# Altium schematic sheet HBridge.SchDoc
size 381 x 241 mm
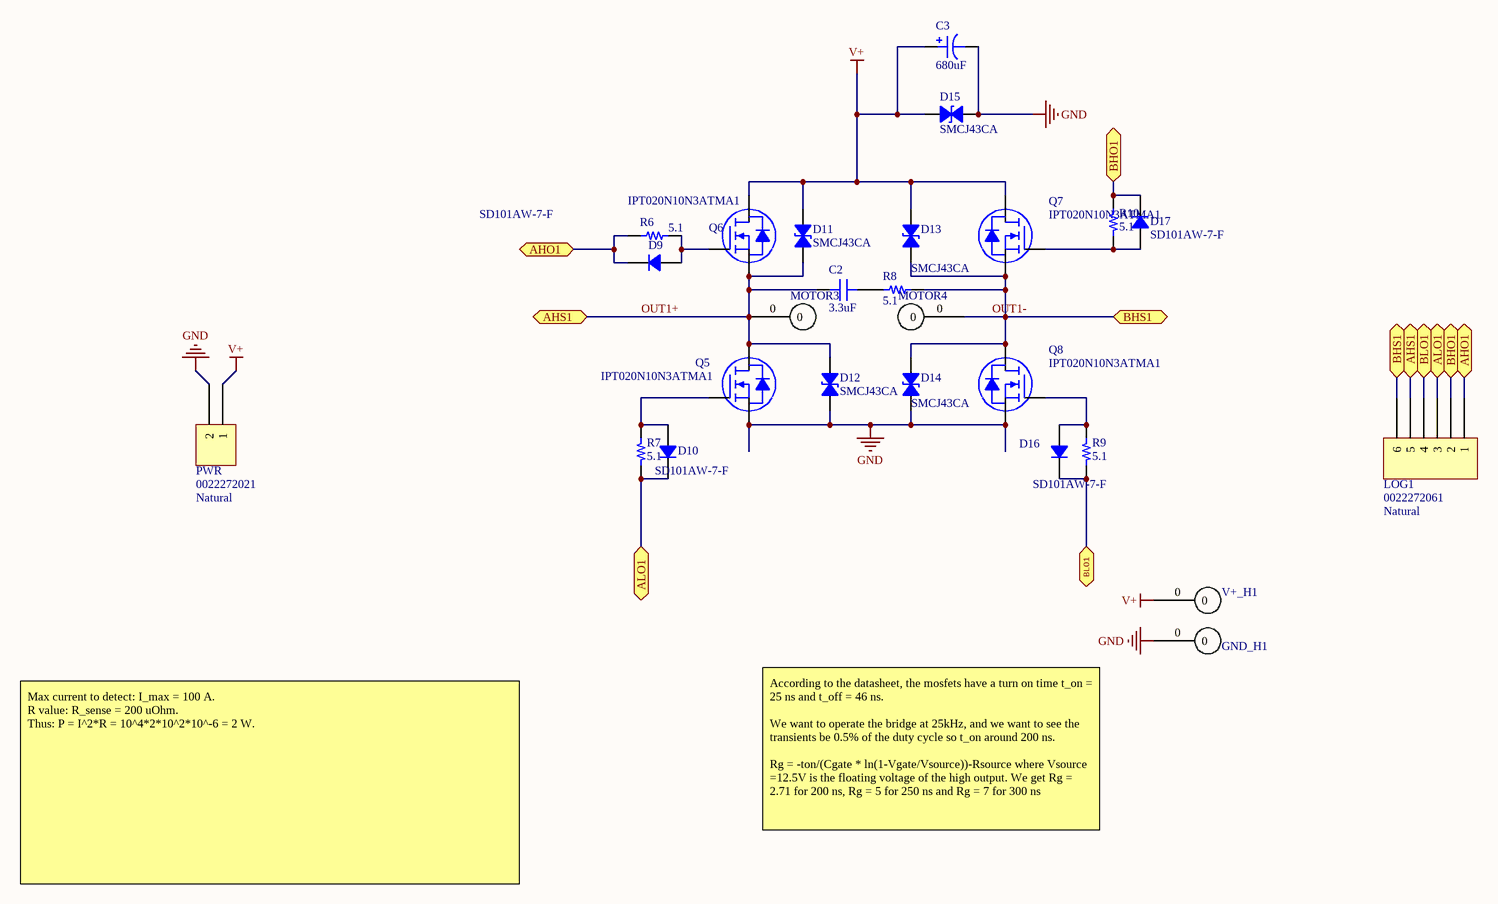
[diagram p0: HBridge.SchDoc]

## Parts
C2  3.3uF  [CAP 1206/3216 - 1.8MM]
C3  680uF  [Radial Capacitor 12.5mm]
D9  SD101AW-7-F  [SOD-123]
D10  SD101AW-7-F  [SOD-123]
D11  SMCJ43CA  [ST DO214AB SMC]
D12  SMCJ43CA  [ST DO214AB SMC]
D13  SMCJ43CA  [ST DO214AB SMC]
D14  SMCJ43CA  [ST DO214AB SMC]
D15  SMCJ43CA  [ST DO214AB SMC]
D16  SD101AW-7-F  [SOD-123]
D17  SD101AW-7-F  [SOD-123]
GND_H1  Cable Hole 6.54mm  [Cable Hole 6.54mm]  (value not drawn)
LOG1  0022272061  Colour: Natural  [MOLEX KK 0022272061]
MOTOR3  H1  [Cable Hole 6.54mm]  (value not drawn)
MOTOR4  H2  [Cable Hole 6.54mm]  (value not drawn)
PWR  0022272021  Colour: Natural  [MOLEX KK 0022272021]
Q5  IPT020N10N3ATMA1  [INFINEON PG-HSOF-8-1]
Q6  IPT020N10N3ATMA1  [INFINEON PG-HSOF-8-1]
Q7  IPT020N10N3ATMA1  [INFINEON PG-HSOF-8-1]
Q8  IPT020N10N3ATMA1  [INFINEON PG-HSOF-8-1]
R6  5.1  [RES 1206/3216]
R7  5.1  [RES 1206/3216]
R8  5.1  [RES 1206/3216]
R9  5.1  [RES 1206/3216]
R10  5.1  [RES 1206/3216]
V+_H1  Cable Hole 6.54mm  [Cable Hole 6.54mm]  (value not drawn)

## Ports
AHO1, AHS1, ALO1, BHO1, BHS1, BLO1

## Nets
GND: C3.2 D12.1 D14.1 D15.2 GND_H1.0 PWR.2 Q5.2(S) Q5.3(S) Q5.4(S) Q5.5(S) Q5.6(S) Q5.7(S) Q5.8(S) Q8.2(S) Q8.3(S) Q8.4(S) Q8.5(S) Q8.6(S) Q8.7(S) Q8.8(S)
V+: C3.1 D11.2 D13.2 D15.1 PWR.1 Q6.9(D) Q7.9(D) V+_H1.0
AHO1: D9.2 LOG1.1 R6.1 ; port AHO1
ALO1: D10.2 LOG1.3 R7.2 ; port ALO1
BHO1: D17.2 LOG1.2 R10.1 ; port BHO1
BLO1: D16.2 LOG1.4 R9.2 ; port BLO1
OUT1+: C2.1 D11.1 D12.2 LOG1.5 MOTOR3.0 Q5.9(D) Q6.2(S) Q6.3(S) Q6.4(S) Q6.5(S) Q6.6(S) Q6.7(S) Q6.8(S) ; port AHS1
OUT1-: D13.1 D14.2 LOG1.6 MOTOR4.0 Q7.2(S) Q7.3(S) Q7.4(S) Q7.5(S) Q7.6(S) Q7.7(S) Q7.8(S) Q8.9(D) R8.2 ; port BHS1
NetC2_2: C2.2 R8.1
NetD9_1: D9.1 Q6.1(G) R6.2
NetD10_1: D10.1 Q5.1(G) R7.1
NetD16_1: D16.1 Q8.1(G) R9.1
NetD17_1: D17.1 Q7.1(G) R10.2

## Notes on the sheet
- According to the datasheet, the mosfets have a turn on time t_on = 25 ns and t_off = 46 ns.
  We want to operate the bridge at 25kHz, and we want to see the transients be 0.5% of the duty cycle so t_on around 200 ns.
  Rg = -ton/(Cgate * ln(1-Vgate/Vsource))-Rsource where Vsource =12.5V is the floating voltage of the high output. We get Rg = 2.71 for 200 ns, Rg = 5 for 250 ns and Rg = 7 for 300 ns
- Max current to detect: I_max = 100 A.
  R value: R_sense = 200 uOhm.
  Thus: P = I^2*R = 10^4*2*10^2*10^-6 = 2 W.

## Library data of the parts
C2 = CGA5L3X7S2A335K160AB: CAP CER 3.3UF 100V X7S 1206; Manufacturer: TDK Corporation; TemperatureRange: -55C ~ 125C; Tolerance: 10%; Value: 3.3uF; Part Number: CGA5L3X7S2A335K160AB; PartId: 17985; Supplier 1: Digi-Key; Supplier Part Number 1: 445-15583-2-ND; ComponentLink1Description: Datasheet; ComponentLink1URL: https://product.tdk.com/info/en/catalog/datasheets/mlcc_automotive_midvoltage_en.pdf; ComponentLink2Description: Digi-Key Listing; ComponentLink2URL: https://www.digikey.com/product-detail/en/tdk-corporation/CGA5L3X7S2A335K160AB/445-15583-2-ND/4278316; TemperatureCoefficient: X7S; Voltage: 100V; Price: 0.6319; Device Package: 1206 (3216 Metric)
C3 = EEUFR1J681L: CAP ALUM 680UF 20% 63V Through Hole; Manufacturer: Panasonic; TemperatureRange: -40C ~ 105C; Type: General Purpose; Ripple Current: 2.78A @ 100kHz; Impedance: 21 mOhms; Lifetime @ Temp: 10000 Hrs @ 105°C; Value: 680uF; Part Number: EEUFR1J681L; PartId: 7484; Supplier 1: Farnell; Supplier Part Number 1: 2079311; ComponentLink1Description: Datasheet; ComponentLink1URL: http://www.farnell.com/datasheets/1897635.pdf?_ga=2.93240925.115427954.1506775348-490126870.1506116288&_gac=1.115494644.1506116288.CjwKCAjw6ZLOBRALEiwAxzyCWz0InfLjFu8mp1t2E94Bo3V2sP4VEUhaMoYFsFDilr1LV; ComponentLink2Description: Farnell Listing; ComponentLink2URL: http://fr.farnell.com/panasonic-electronic-components/eeufr1j681l/condensateur-elec-alu-680uf-63v/dp/2079311; Tolerance: 20%; Voltage: 63V; Price: 1.93; Device Package: Radial, Can
D9 D10 D16 D17 = SD101AW-7-F: DIODE SCHOTTKY 60V 15MA SOD123; Manufacturer: Diodes Incorporated; Current Reverse Leakage @ Vr: 200nA @ 50V; Reverse Recovery Time (trr): 1ns; Current Rectified: 15mA (DC); Voltage Forward (Vf): 1V @ 15mA; Part Number: SD101AW-7-F; PartId: 14608; Supplier 1: Digi-Key; Supplier Part Number 1: SD101AW-7FDITR-ND; ComponentLink1Description: Datasheet; ComponentLink1URL: http://www.diodes.com/_files/datasheets/ds11012.pdf; ComponentLink2Description: Digi-Key Listing; ComponentLink2URL: https://www.digikey.com/product-detail/en/diodes-incorporated/SD101AW-7-F/SD101AW-7FDITR-ND/1155357; Junction Operating Temperature: -65C ~ 125C; Price: 0.081; Type: Schottky; Device Package: SOD-123; Voltage DC Reverse (Vr): 60V
D11-D15 = SMCJ43CA: TVS DIODE 43VWM 69.4VC SMC; Manufacturer: FAIRCHILD; Type: Zener; Bidirectional Channels: 1; Power - Peak Pulse: 1500W (1.5kW); Current - Peak Pulse: 21.6 (10/1000); Voltage (Clamping): 69.4V; Voltage (Breakdown): 52.8V; Voltage (Reverse Standoff): 43V; Part Number: SMCJ43CA; PartId: 14960; Supplier 1: Farnell; Supplier Part Number 1: 1651632; ComponentLink1Description: Datasheet; ComponentLink1URL: https://www.fairchildsemi.com/datasheets/SM/SMCJ100A.pdf; ComponentLink2Description: Farnell Listing; ComponentLink2URL: http://fr.farnell.com/on-semiconductor-fairchild/smcj43ca/diode-tvs/dp/1651632; Operating Temperature: -55C ~ 150C (TJ); Price: 0.492; Device Package: DO-214AB, SMC
GND_H1 MOTOR3 MOTOR4 V+_H1 = Cable Pad AWG 2: Number of Positions: 1; Part Number: Cable Pad AWG 2; PartId: 10977
LOG1 = 0022272061: CONN HEADER 6POS .100 VERT TIN; Manufacturer: Molex, LLC; Pitch: 0.100" (2.54mm); Number Of Positions: 6; Part Number: 0022272061; PartId: 9723; Supplier 1: Digi-Key; Supplier Part Number 1: WM4115-ND; ComponentLink1Description: Datasheet; ComponentLink1URL: http://www.molex.com/pdm_docs/sd/022272061_sd.pdf; ComponentLink2Description: Digi-Key Listing; ComponentLink2URL: http://www.digikey.com/product-search/en?keywords=22-27-2061; Price: 0.47; Type: Header, Unshrouded; Contact Finish: Tin; Fastening Type: Friction Lock; Number Of Rows: 1; Series: KK 6410
PWR = 0022272021: CONN HEADER 2POS .100 VERT TIN; Manufacturer: Molex, LLC; Pitch: 0.100" (2.54mm); Number Of Positions: 2; Part Number: 0022272021; PartId: 9719; Supplier 1: Digi-Key; Supplier Part Number 1: WM4111-ND; ComponentLink1Description: Datasheet; ComponentLink1URL: http://www.molex.com/pdm_docs/sd/022272021_sd.pdf; ComponentLink2Description: Digi-Key Listing; ComponentLink2URL: http://www.digikey.com/product-search/en?keywords=22-27-2021; Price: 0.25; Type: Header, Unshrouded; Contact Finish: Tin; Fastening Type: Friction Lock; Number Of Rows: 1; Series: KK 6410
Q5-Q8 = IPT020N10N3ATMA1: MOSFET N-CH 100V 300A 8HSOF; Manufacturer: Infineon Technologies; Type: MOSFET N-Channel, Metal Oxide; Rds On (Max) at Id, Vgs: 2 mOhm @ 150A, 10V; Vgs(th) (Max) at Id: 3.5V @ 272uA; Gate Charge (Qg): 156nC @ 10V; Input Capacitance (Ciss) at Vds: 11200pF @ 50V; Power - Max: 375W; Current Continuous Drain: 300A (Tc); Part Number: IPT020N10N3ATMA1; PartId: 7970; Supplier 1: Digi-Key; Supplier Part Number 1: IPT020N10N3ATMA1TR-ND; ComponentLink1Description: Datasheet; ComponentLink1URL: http://www.infineon.com/dgdl/IPT020N10N3_Rev1.1.pdf?folderId=db3a304313b8b5a60113cee8763b02d7&fileId=db3a30433e9d5d11013e9e58035b0158; ComponentLink2Description: Digi-Key Listing; ComponentLink2URL: http://www.digikey.com/product-detail/en/IPT020N10N3ATMA1/IPT020N10N3ATMA1TR-ND/4571872; Price: 3.3442; Device Package: 8-PowerSFN; Drain to Source Voltage (Vdss): 100V; Features: Standard
R6-R10 = ERJ-8GEYJ5R1V: RES SMD 5.1 OHM 5% 1/4W 1206; Manufacturer: Panasonic Electronic Components; TemperatureRange: -55C ~ 155C; TemperatureCoefficient: -100/ +600ppm/C; PowerRating: 0.25W, 1/4W; Value: 5.1; Part Number: ERJ-8GEYJ5R1V; PartId: 11913; Supplier 1: Digi-Key; Supplier Part Number 1: P5.1ETR-ND; ComponentLink1Description: Datasheet; ComponentLink1URL: http://industrial.panasonic.com/www-cgi/jvcr13pz.cgi?E+PZ+3+AOA0001+ERJ8GEYJ5R1V+7+WW; ComponentLink2Description: Digi-Key Listing; ComponentLink2URL: https://www.digikey.com/product-detail/en/panasonic-electronic-components/ERJ-8GEYJ5R1V/P5.1ETR-ND/282211; Tolerance: 5%; Price: 0.0045; Device Package: 1206 (3216 Metric)